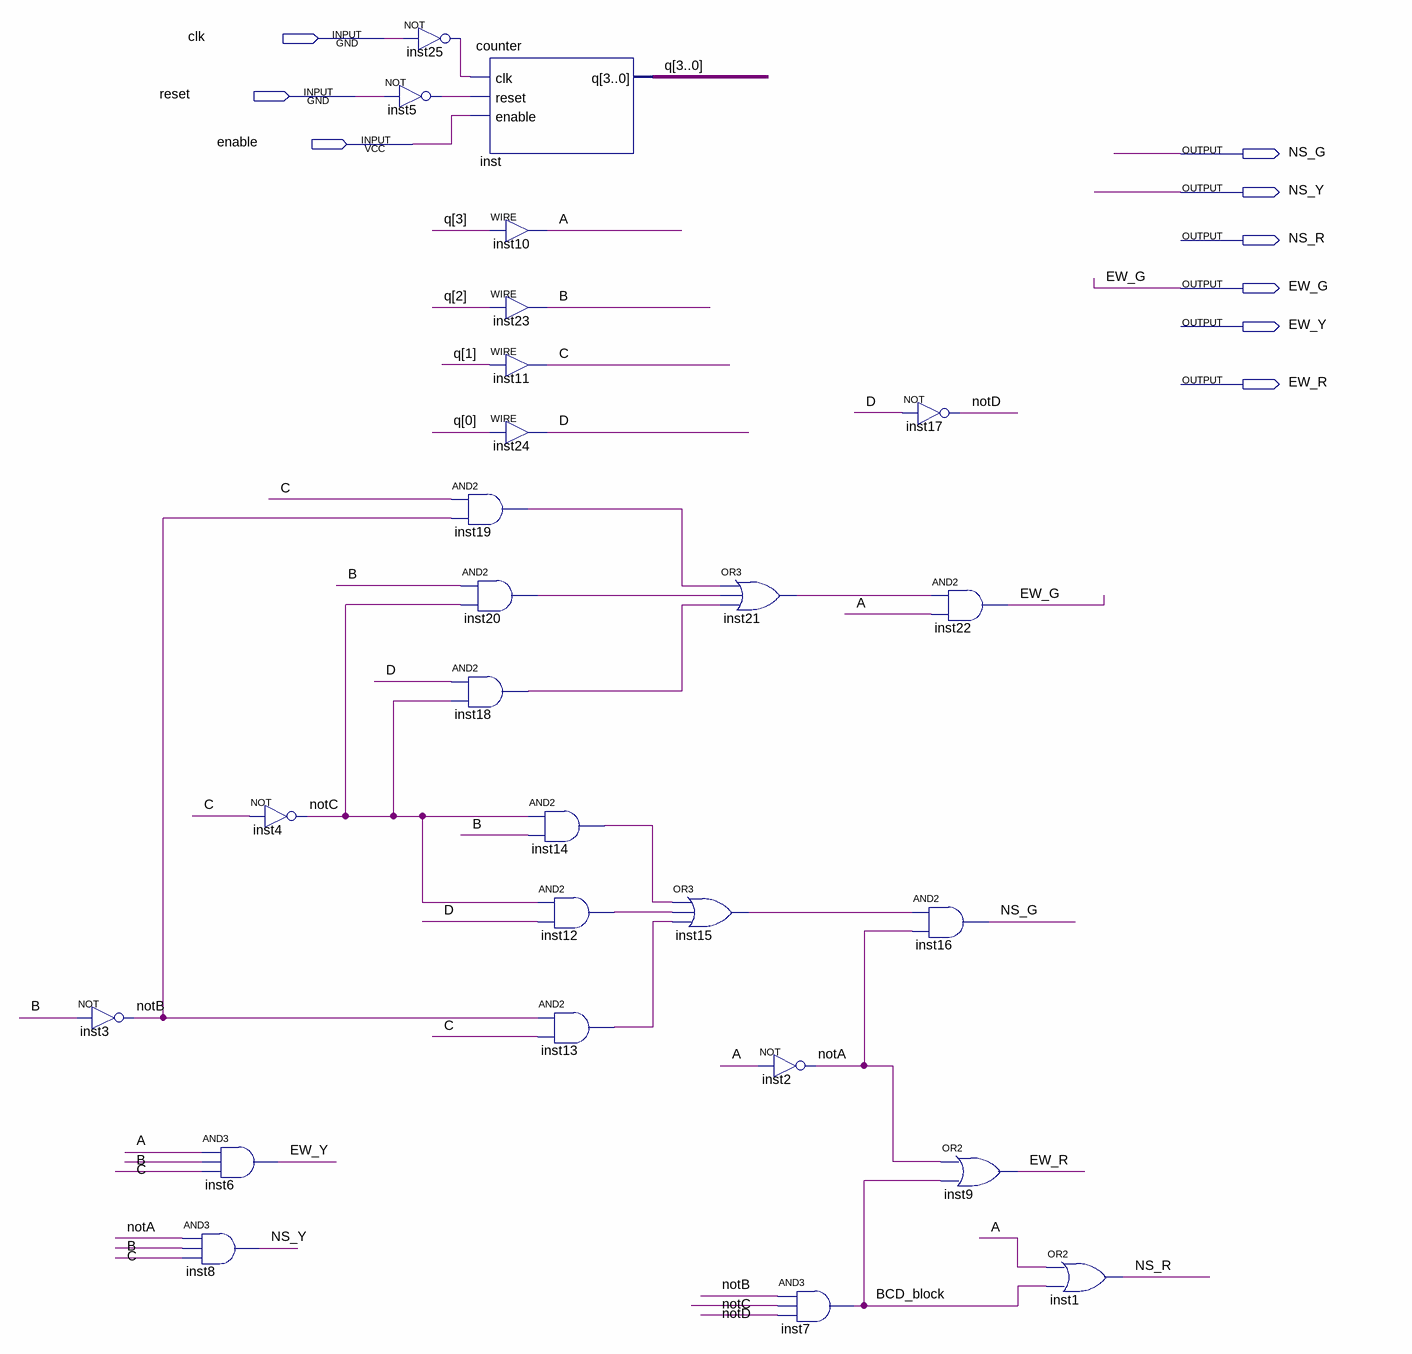
[diagram p0: schematic sheet]
// Quartus schematic traffic.bdf as structural Verilog: 26 symbols, 9 pins
module traffic (
  input  clk,
  input  reset,
  input  enable,
  output NS_G,
  output NS_Y,
  output NS_R,
  output EW_G,
  output EW_Y,
  output EW_R
);

  wire A, B, BCD_block, C, D, inst5_out, inst12_out, inst13_out, inst14_out, inst15_out, inst18_out,
       inst19_out, inst20_out, inst21_out, inst25_out, notA, notB, notC, notD;
  wire [3:0] q;

  not inst3 (notB, B);
  and inst6 (EW_Y, A, B, C);
  and inst8 (NS_Y, notA, B, C);
  not inst4 (notC, C);
  not inst25 (inst25_out, clk);
  not inst5 (inst5_out, reset);
  counter inst (.clk(inst25_out), .reset(inst5_out), .enable(enable), .q(q));
  assign A = q[3];  // WIRE inst10
  assign B = q[2];  // WIRE inst23
  assign C = q[1];  // WIRE inst11
  assign D = q[0];  // WIRE inst24
  and inst19 (inst19_out, C, notB);
  and inst20 (inst20_out, B, notC);
  and inst18 (inst18_out, D, notC);
  and inst14 (inst14_out, notC, B);
  and inst12 (inst12_out, notC, D);
  and inst13 (inst13_out, notB, C);
  or inst15 (inst15_out, inst14_out, inst12_out, inst13_out);
  or inst21 (inst21_out, inst19_out, inst20_out, inst18_out);
  not inst2 (notA, A);
  and inst7 (BCD_block, notB, notC, notD);
  not inst17 (notD, D);
  and inst22 (EW_G, inst21_out, A);
  and inst16 (NS_G, inst15_out, notA);
  or inst9 (EW_R, notA, BCD_block);
  or inst1 (NS_R, A, BCD_block);
endmodule
